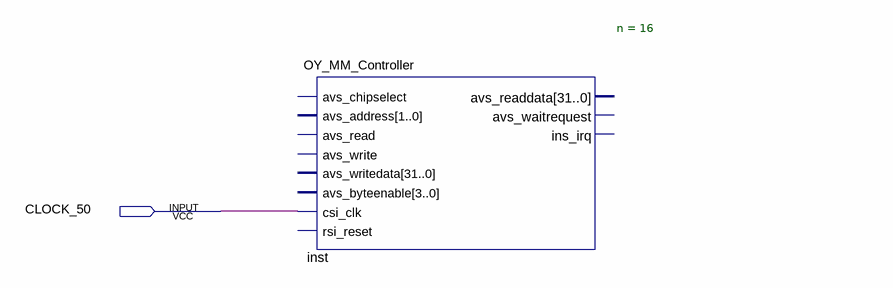
[diagram p0: schematic sheet]
// Quartus schematic OY_Controller_Block.bdf as structural Verilog: 1 symbols, 1 pins
module OY_Controller_Block (
  input  CLOCK_50
);

  OY_MM_Controller #(.n(16)) inst (.csi_clk(CLOCK_50));  // open: avs_chipselect, avs_address, avs_read, avs_write, avs_writedata, avs_byteenable, rsi_reset, avs_readdata, avs_waitrequest, ins_irq
endmodule
